# EAGLE design dengenn (EAGLE 9.6.2)
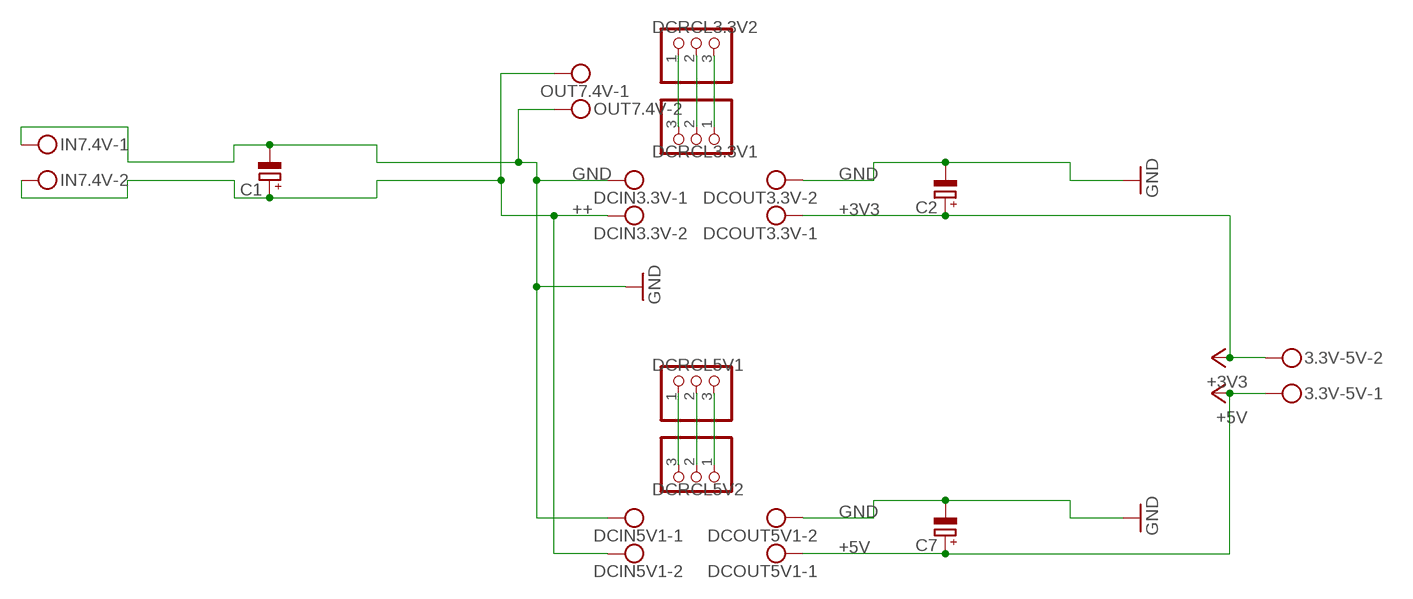
[diagram p0: schematic, sheet 1]

## Parts
3.3V-5V  MKDSN1,5/2-5,08  [MKDSN1,5/2-5,08]
C1  CPOL-EUE5-10.5  [E5-10,5]
C2  CPOL-EUE5-10.5  [E5-10,5]
C7  CPOL-EUE5-10.5  [E5-10,5]
DCIN3.3V  MKDSN1,5/2-5,08  [MKDSN1,5/2-5,08]
DCIN5V1  MKDSN1,5/2-5,08  [MKDSN1,5/2-5,08]
DCOUT3.3V  MKDSN1,5/2-5,08  [MKDSN1,5/2-5,08]
DCOUT5V1  MKDSN1,5/2-5,08  [MKDSN1,5/2-5,08]
DCRCL3.3V1  PINHD-1X3  [1X03]
DCRCL3.3V2  PINHD-1X3  [1X03]
DCRCL5V1  PINHD-1X3  [1X03]
DCRCL5V2  PINHD-1X3  [1X03]
IN7.4V  MKDSN1,5/2-5,08  [MKDSN1,5/2-5,08]
OUT7.4V  MKDSN1,5/2-5,08  [MKDSN1,5/2-5,08]

## Nets
+3V3: 3.3V-5V.2 C2.+ DCOUT3.3V.1
+5V: 3.3V-5V.1 C7.+ DCOUT5V1.1
++: C1.+ DCIN3.3V.2 DCIN5V1.2 IN7.4V.2 OUT7.4V.1
GND: C1.- C2.- C7.- DCIN3.3V.1 DCIN5V1.1 DCOUT3.3V.2 DCOUT5V1.2 IN7.4V.1 OUT7.4V.2
N$3: DCRCL3.3V1.3 DCRCL3.3V2.1
N$6: DCRCL3.3V1.2 DCRCL3.3V2.2
N$8: DCRCL3.3V1.1 DCRCL3.3V2.3
N$11: DCRCL5V1.1 DCRCL5V2.3
N$13: DCRCL5V1.2 DCRCL5V2.2
N$18: DCRCL5V1.3 DCRCL5V2.1

## Library data of the parts
3.3V-5V DCIN3.3V DCIN5V1 DCOUT3.3V DCOUT5V1 IN7.4V OUT7.4V = con-phoenix-508:MKDSN1,5/2-5,08: MKDSN 1,5/ 2-5,08 Printklemme Nennstrom: 13,5 A Nennspannung: 250 V Rastermaß: 5,08 mm Polzahl: 2 Anschlussart: Schraubanschluss Montage: Löten Anschlussrichtung Leiter/Platine: 0 ° Artikelnummer: 1729128 Source: http://eshop.phoenixcontact.com .. 1729128.pdf
C1 C2 C7 = rcl:CPOL-EU: POLARIZED CAPACITOR, European symbol; SPICEPREFIX: C
DCRCL3.3V1 DCRCL3.3V2 DCRCL5V1 DCRCL5V2 = adafruit:PINHD-1X3: PIN HEADER

## Net classes
0 default: width 0.5 mm, clearance 0.3 mm

## Board
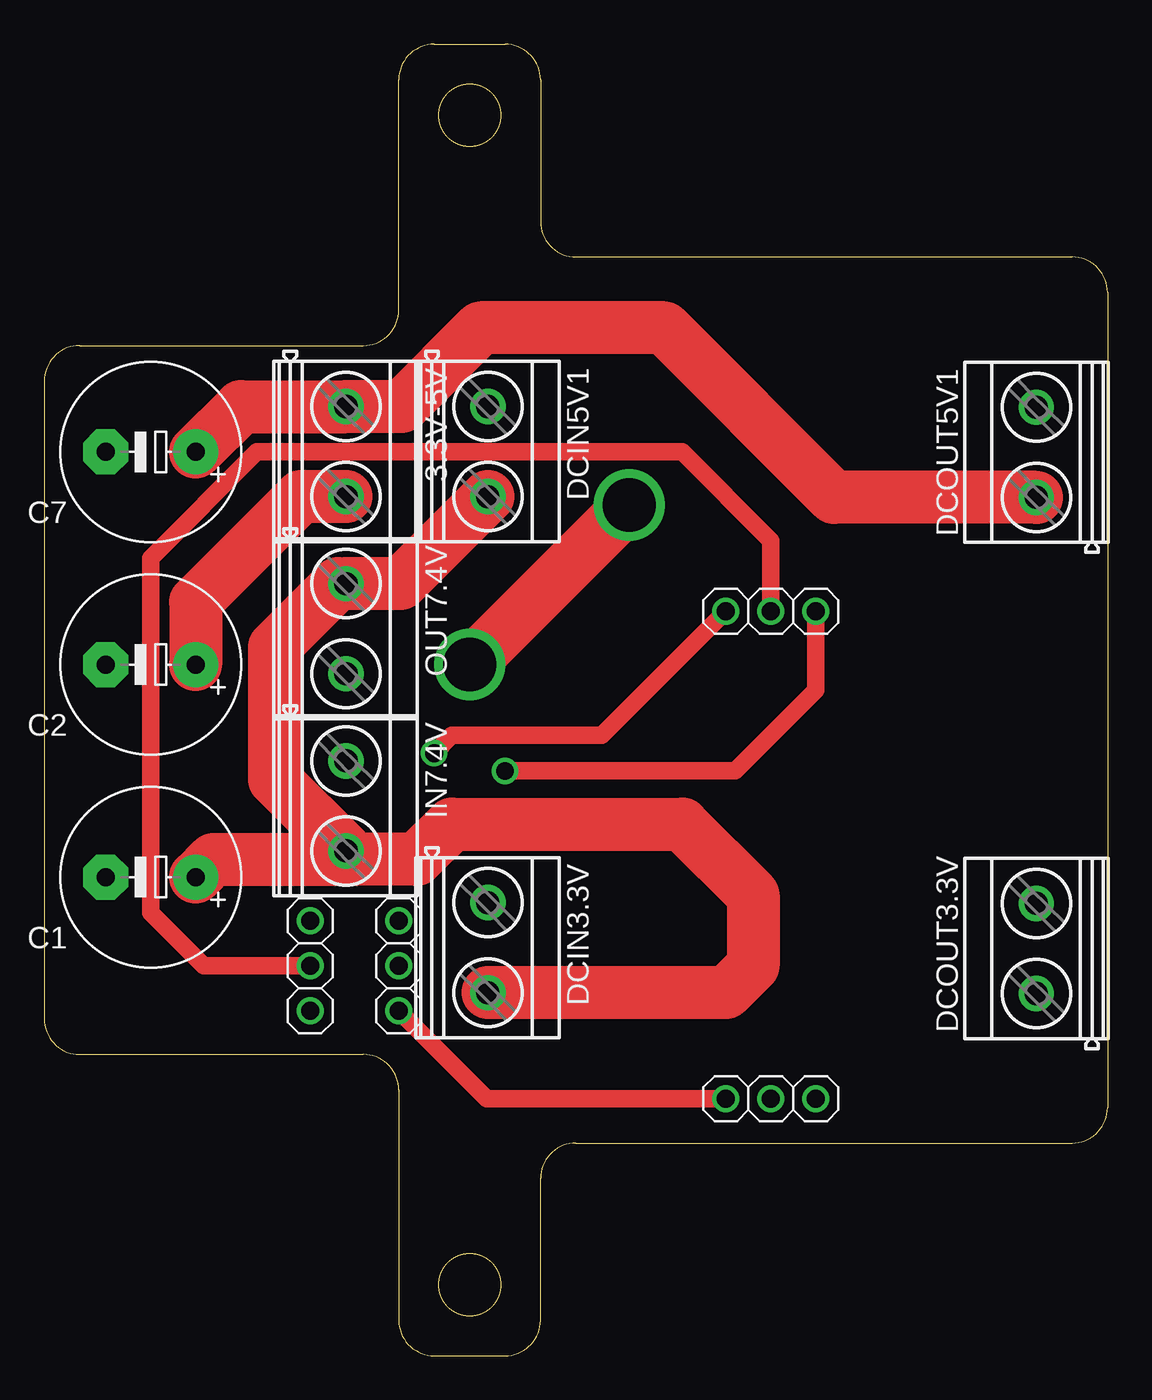
[diagram p1: board, top side]
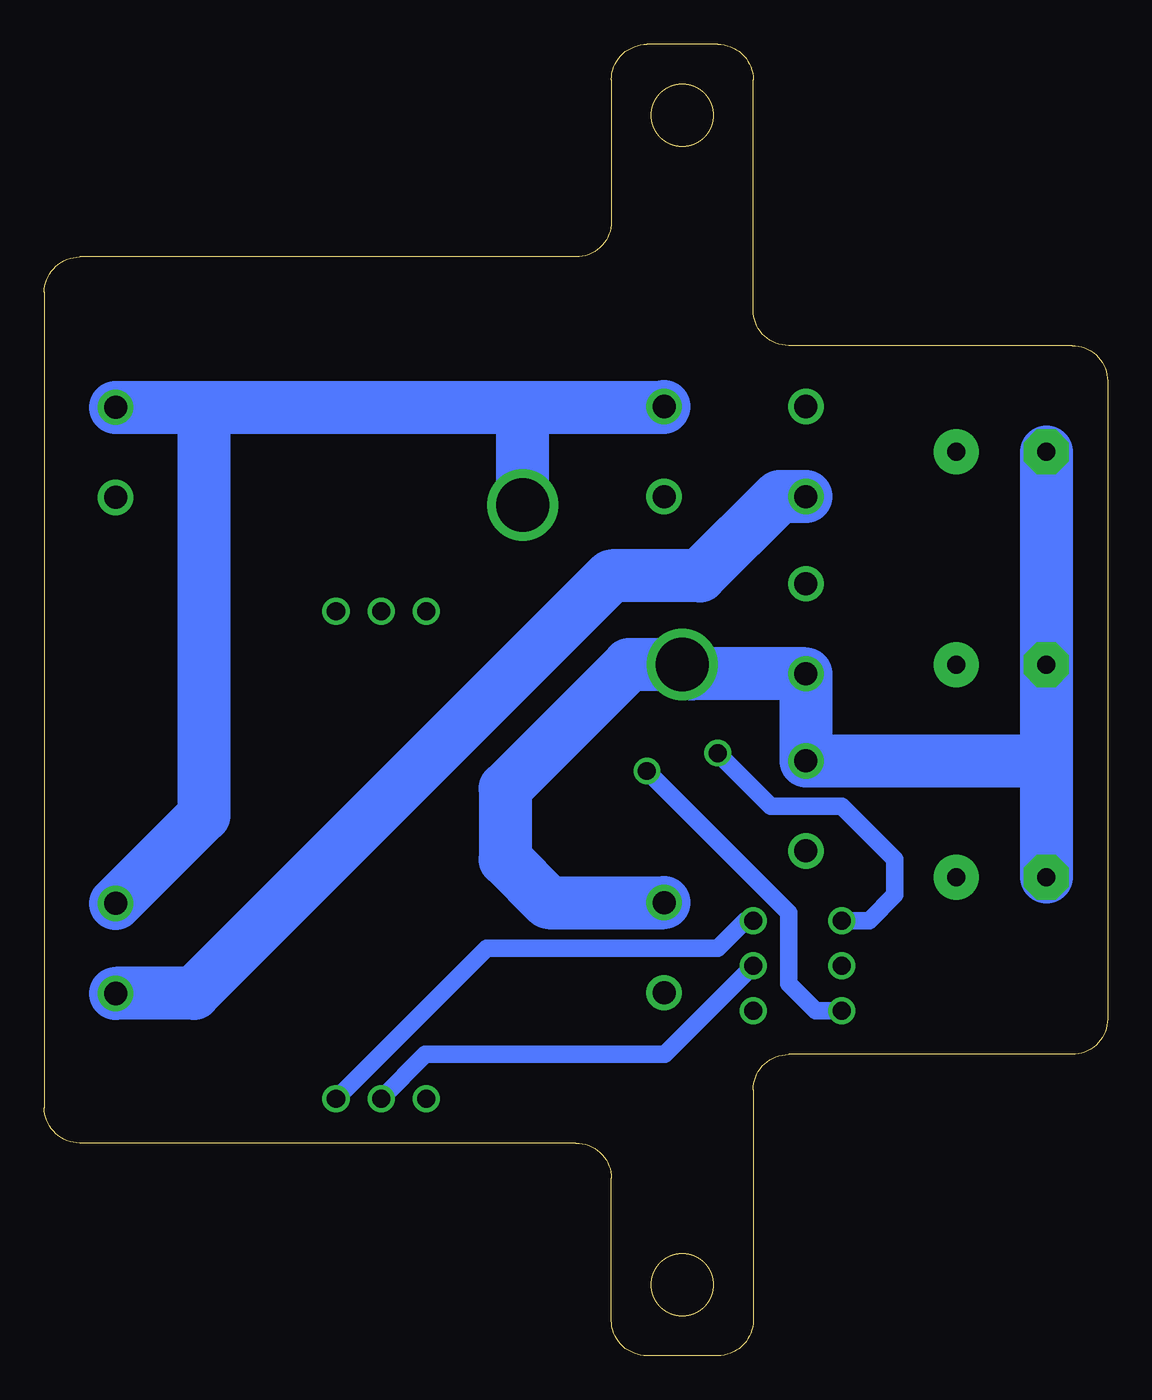
[diagram p2: board, bottom side, seen from below]

Size 60 x 74 mm. Coordinates in mm from the lower left corner, seen from the top.
Outline: 18,57 arc90 20,59 20,72 arc-90 22,74 26,74 arc-90 28,72 28,64 arc90 30,62 58,62 arc-90 60,60 60,14 arc-90 58,12 30,12 arc90 28,10 28,2 arc-90 26,0 22,0 arc-90 20,2 20,15 arc90 18,17 2,17 arc-90 0,19 0,55 arc-90 2,57 18,57
Outline: circle at 24,70 radius 1.75
Outline: circle at 24,4 radius 1.75
Copper layers (1*16): Top 0.035mm / dielectric 1.5mm / Bottom 0.035mm
Design rules "default": minimum track width 6mil, minimum drill 0.35mm, track to track 6mil, track to pad 6mil, pad to pad 6mil, via to via 6mil, smd to smd 6mil, copper to edge 40mil, drill to drill 6mil, minimum pad ring 10mil, minimum via ring 8mil, stop-mask expansion 4mil, vias tented up to drill 0mil, thermal gap 10mil

### Footprints (pad centres in the part's own frame; a part is rotated, then mirrored left to right if it is on the bottom)
MKDSN1,5/2-5,08 = drill 1.3 pad 2: 1 -2.561,0.025; 2 2.519,0.025
E5-10,5 = drill 1.016 pad 2.54: + -2.54,0 | drill 1.016 pad 2.54 octagon: - 2.54,0
1X03 = drill 1.016: 1 -2.54,0; 2 0,0; 3 2.54,0

### Placement (x,y rotation side)
3.3V-5V  17,51 270 top
C1  6,27 180 top
C2  6,39 180 top
C7  6,51 180 top
DCIN3.3V  25,23 270 top
DCIN5V1  25,51 270 top
DCOUT3.3V  56,23 90 top
DCOUT5V1  56,51 90 top
DCRCL3.3V1  41,42 180 top
DCRCL3.3V2  15,22 270 top
DCRCL5V1  41,14.5 0 top
DCRCL5V2  20,22 270 top
IN7.4V  17,31 270 top
OUT7.4V  17,41 270 top

### Tracks (layer width: path | path; a pad name or v marks a point on that pad's centre or on a via)
+3V3
  Top 3: 3.3V-5V.2 14.48,48.48 8.54,42.54 C2.+
  Bottom 3: 3.3V-5V.2 18.52,48.48 23,44 28,44 51.56,20.44 DCOUT3.3V.1
+5V
  Top 3: DCOUT5V1.1 44.56,48.44 35,58 24.61,58 20.17,53.56 3.3V-5V.1 11.1,53.56 C7.+
++
  Top 3: DCIN5V1.2 20.11,43.56 OUT7.4V.1 16.56,43.56 13,40 13,32.51 IN7.4V.2 17.51,28 | 17.51,28 21,28 23,30 36,30 40,26 40,22 38.48,20.48 DCIN3.3V.2 | C1.+ 9.54,28 17.51,28
GND  (via drill 3)
  Top 3: v24,39 v33,48
  Bottom 3: DCOUT5V1.2 51,53.52 | 51,53.52 33,53.52 | 33,53.52 25.07,53.52 DCIN5V1.1 | DCOUT3.3V.2 51,30.49 51,53.52 | v33,48 33,53.52 | C7.- C2.- 3.46,33 | 3.46,33 C1.- | 3.46,33 4.02,33.56 IN7.4V.1 OUT7.4V.2 23.48,38.48 v24,39 27,39 34,32 34,28 31.56,25.56 DCIN3.3V.1
N$3  (via drill 1)
  Top 1: DCRCL3.3V1.3 31.46,35 23,35 v22,34
  Bottom 1: v22,34 19,31 15,31 12,28 12,26 13.46,24.54 DCRCL3.3V2.1
N$6
  Top 1: DCRCL3.3V1.2 41,46 36,51 12,51 6,45 6,25 9,22 DCRCL3.3V2.2
N$8  (via drill 1)
  Top 1: DCRCL3.3V1.1 43.54,37.54 39,33 v26,33
  Bottom 1: DCRCL3.3V2.3 16.46,19.46 18,21 18,25 v26,33
N$11
  Top 1: DCRCL5V2.3 24.96,14.5 DCRCL5V1.1
N$13
  Bottom 1: DCRCL5V1.2 38.5,17 25,17 DCRCL5V2.2
N$18
  Bottom 1: DCRCL5V2.1 20.46,24.54 22,23 35.04,23 DCRCL5V1.3